# Altium schematic sheet 05_LMS7002M_RF.SchDoc: LMS7002M RF
size A3 portrait; Organization: Lime Microsystems; Address1: Surrey Tech Centre; Address2: Guildford GU2 7YG; Address3: Surrey; Address4: United Kingdom; Revision: v1.3; SheetNumber: 5; SheetTotal: 9; PageSetup: Record=PageOptions|CenterHorizontal=True|CenterVertical=True|PrintScale=0.70|XCorrection=1.00|YCorrection=1.00|PrintKind=1|BorderSize=5000000|LeftOffset=0|BottomOffset=0|Orientation=1|PaperLength=2970|PaperWidth=2100|Scale=100|PaperSource=7|PrintQuality=600|MediaType=1|DitherType=10|PrintScaleMode=1|PaperKind=A4|PaperIndex=9
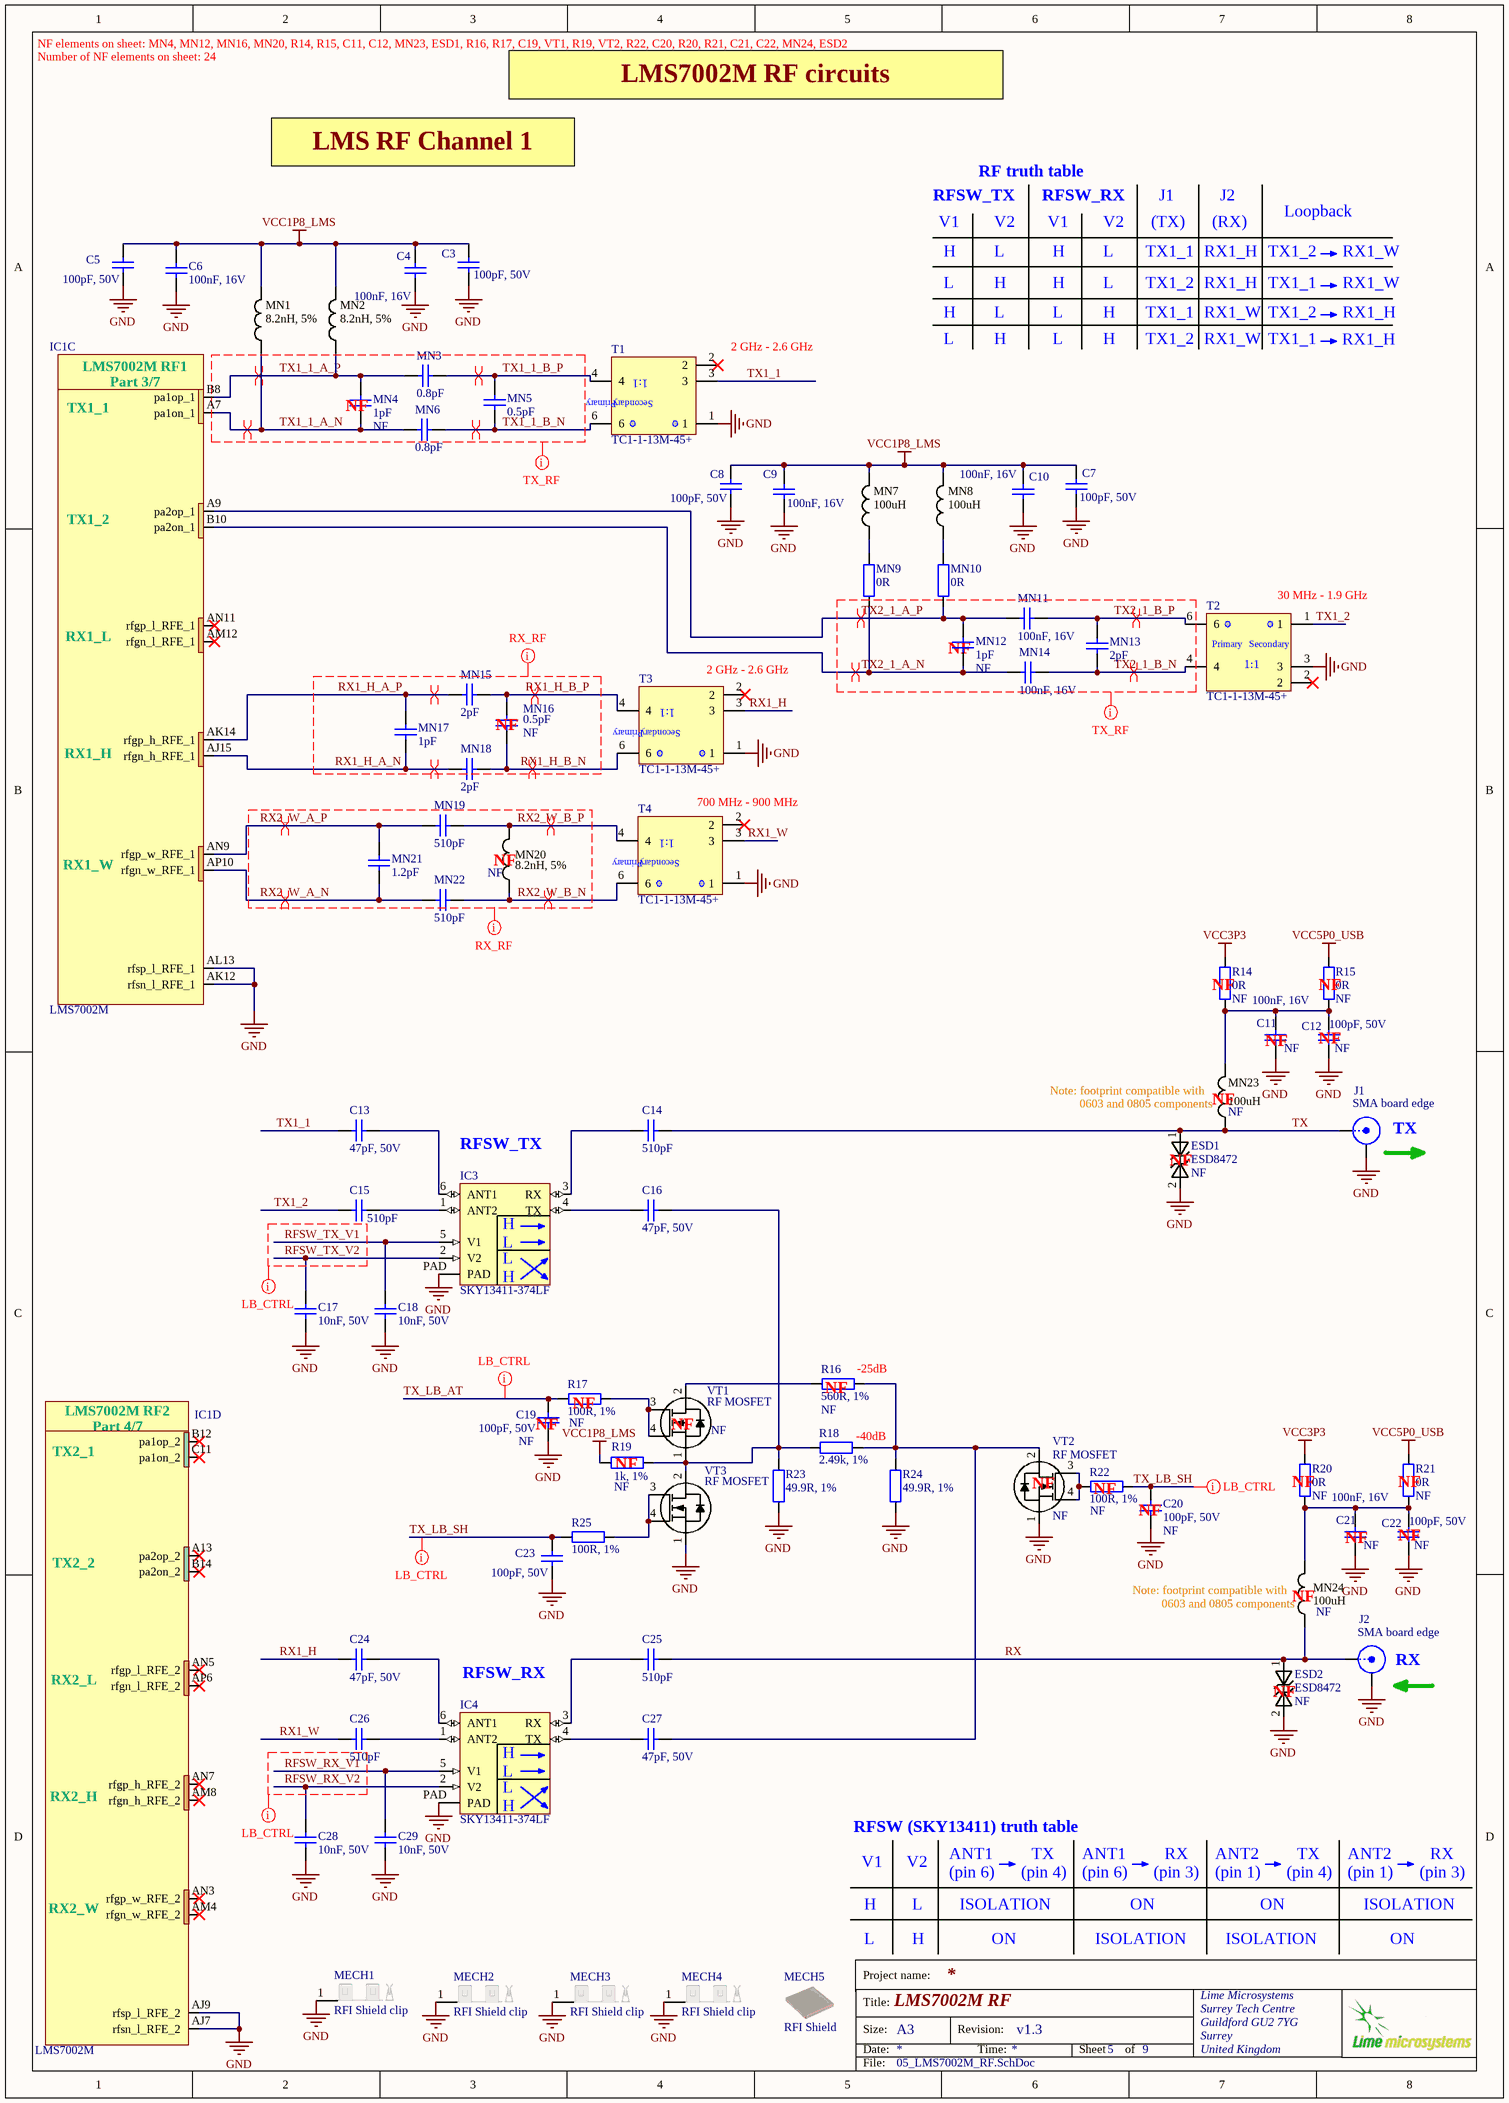
[diagram p0: 05_LMS7002M_RF.SchDoc]

## Parts
C3  100pF, 50V  [CAP0402]
C4  100nF, 16V  [CAP0402]
C5  100pF, 50V  [CAP0402]
C6  100nF, 16V  [CAP0402]
C7  100pF, 50V  [CAP0402]
C8  100pF, 50V  [CAP0402]
C9  100nF, 16V  [CAP0402]
C10  100nF, 16V  [CAP0402]
C11  100nF, 16V  Assembly Info: NF  [CAP0402]
C12  100pF, 50V  Assembly Info: NF  [CAP0402]
C13  47pF, 50V  [CAP0402]
C14  510pF  [CAP0402]
C15  510pF  [CAP0402]
C16  47pF, 50V  [CAP0402]
C17  10nF, 50V  [CAP0402]
C18  10nF, 50V  [CAP0402]
C19  100pF, 50V  Assembly Info: NF  [CAP0402]
C20  100pF, 50V  Assembly Info: NF  [CAP0402]
C21  100nF, 16V  Assembly Info: NF  [CAP0402]
C22  100pF, 50V  Assembly Info: NF  [CAP0402]
C23  100pF, 50V  [CAP0402]
C24  47pF, 50V  [CAP0402]
C25  510pF  [CAP0402]
C26  510pF  [CAP0402]
C27  47pF, 50V  [CAP0402]
C28  10nF, 50V  [CAP0402]
C29  10nF, 50V  [CAP0402]
ESD1  ESD8472  Assembly Info: NF  [ESD8472_X3DFN2]
ESD2  ESD8472  Assembly Info: NF  [ESD8472_X3DFN2]
IC1  LMS7002M  [LMS7002M_v5]  (parts C,D of 7)
IC3  SKY13411-374LF  [SKY13411-374LF]
IC4  SKY13411-374LF  [SKY13411-374LF]
J1  SMA board edge  [SMA_connector_board_edge_SM]
J2  SMA board edge  [SMA_connector_board_edge_SM]
MECH1  RFI Shield clip  [RFI_SHIELD_CLPS_MINI]
MECH2  RFI Shield clip  [RFI_SHIELD_CLPS_MINI]
MECH3  RFI Shield clip  [RFI_SHIELD_CLPS_MINI]
MECH4  RFI Shield clip  [RFI_SHIELD_CLPS_MINI]
MECH5  RFI Shield  [WurthElectronic_RF_shield]
MN1  8.2nH, 5%  [RES0402]
MN2  8.2nH, 5%  [RES0402]
MN3  0.8pF  [CAP0402]
MN4  1pF  Assembly Info: NF  [CAP0402]
MN5  0.5pF  [CAP0402]
MN6  0.8pF  [CAP0402]
MN7  100uH  [RES0805]
MN8  100uH  [RES0805]
MN9  0R  [RES0402]
MN10  0R  [RES0402]
MN11  100nF, 16V  [CAP0402]
MN12  1pF  Assembly Info: NF  [CAP0402]
MN13  2pF  [CAP0402]
MN14  100nF, 16V  [CAP0402]
MN15  2pF  [CAP0402]
MN16  0.5pF  Assembly Info: NF  [CAP0402]
MN17  1pF  [CAP0402]
MN18  2pF  [CAP0402]
MN19  510pF  [CAP0402]
MN20  8.2nH, 5%  Assembly Info: NF  [RES0402]
MN21  1.2pF  [CAP0402]
MN22  510pF  [CAP0402]
MN23  100uH  Assembly Info: NF  [RES0805_0603]
MN24  100uH  Assembly Info: NF  [RES0805_0603]
R14  0R  Assembly Info: NF  [RES0402]
R15  0R  Assembly Info: NF  [RES0402]
R16  560R, 1%  Assembly Info: NF  [RES0402]
R17  100R, 1%  Assembly Info: NF  [RES0402]
R18  2.49k, 1%  [RES0402]
R19  1k, 1%  Assembly Info: NF  [RES0402]
R20  0R  Assembly Info: NF  [RES0402]
R21  0R  Assembly Info: NF  [RES0402]
R22  100R, 1%  Assembly Info: NF  [RES0402]
R23  49.9R, 1%  [RES0402]
R24  49.9R, 1%  [RES0402]
R25  100R, 1%  [RES0402]
T1  TC1-1-13M-45+  [TC1-1-13MA+_JA4220-AL_]
T2  TC1-1-13M-45+  [TC1-1-13MA+_JA4220-AL_]
T3  TC1-1-13M-45+  [TC1-1-13MA+_JA4220-AL_]
T4  TC1-1-13M-45+  [TC1-1-13MA+_JA4220-AL_]
VT1  RF MOSFET  Assembly Info: NF  [BF1105R_SOT143R4]
VT2  RF MOSFET  Assembly Info: NF  [BF1105R_SOT143R4]
VT3  RF MOSFET  [BF1105R_SOT143R4]

## Nets
GND: C3.2 C4.1 C5.2 C6.1 C7.2 C8.2 C9.1 C10.1 C11.1 C12.2 C17.1 C18.1 C19.2 C20.2 C21.1 C22.2 C23.2 C28.1 C29.1 ESD1.2 ESD2.2 IC1.AJ7(rfsn_l_RFE_2) IC1.AJ9(rfsp_l_RFE_2) IC1.AK12(rfsn_l_RFE_1) IC1.AL13(rfsp_l_RFE_1) IC3.PAD IC4.PAD J1.2(Y) J2.2(Y) MECH1.1(GND) MECH2.1(GND) MECH3.1(GND) MECH4.1(GND) R23.1 R24.1 T1.1 T2.3 T3.1 T4.1 VT2.1(S) VT3.1(S)
VCC1P8_LMS: C3.1 C4.2 C5.1 C6.2 C7.1 C8.1 C9.2 C10.2 MN1.2 MN2.2 MN7.2 MN8.2 R19.2
VCC3P3: R14.1 R20.1
VCC5P0_USB: R15.1 R21.1
RFSW_RX_V1: C29.2 IC4.5(V1)
RFSW_RX_V2: C28.2 IC4.2(V2)
RFSW_TX_V1: C18.2 IC3.5(V1)
RFSW_TX_V2: C17.2 IC3.2(V2)
RX: C25.2 ESD2.1 J2.1(X) MN24.1
RX1_H: C24.2 T3.3
RX1_H_A_N: IC1.AJ15(rfgn_h_RFE_1) MN17.1 MN18.2
RX1_H_A_P: IC1.AK14(rfgp_h_RFE_1) MN15.2 MN17.2
RX1_H_B_N: MN16.1 MN18.1 T3.6
RX1_H_B_P: MN15.1 MN16.2 T3.4
RX1_W: C26.2 T4.3
RX2_W_A_N: IC1.AP10(rfgn_w_RFE_1) MN21.1 MN22.2
RX2_W_A_P: IC1.AN9(rfgp_w_RFE_1) MN19.2 MN21.2
RX2_W_B_N: MN20.1 MN22.1 T4.6
RX2_W_B_P: MN19.1 MN20.2 T4.4
TX: C14.2 ESD1.1 J1.1(X) MN23.1
TX1_1: C13.2 T1.3
TX1_1_A_N: IC1.A7(pa1on_1) MN1.1 MN4.1 MN6.2
TX1_1_A_P: IC1.B8(pa1op_1) MN2.1 MN3.1 MN4.2
TX1_1_B_N: MN5.2 MN6.1 T1.6
TX1_1_B_P: MN3.2 MN5.1 T1.4
TX1_2: C15.2 T2.1
TX2_1_A_N: IC1.B10(pa2on_1) MN9.1 MN12.2 MN14.1
TX2_1_A_P: IC1.A9(pa2op_1) MN10.1 MN11.2 MN12.1
TX2_1_B_N: MN13.1 MN14.2 T2.4
TX2_1_B_P: MN11.1 MN13.2 T2.6
TX_LB_AT: C19.1 R17.2
TX_LB_SH: C20.1 C23.1 R22.1 R25.2
NetC11_2: C11.2 C12.1 MN23.2 R14.2 R15.2
NetC13_1: C13.1 IC3.6(ANT1)
NetC14_1: C14.1 IC3.3(RX)
NetC15_1: C15.1 IC3.1(ANT2)
NetC16_1: C16.1 IC3.4(TX)
NetC16_2: C16.2 R18.1 R19.1 R23.2 VT1.1(S) VT3.2(D)
NetC21_2: C21.2 C22.1 MN24.2 R20.2 R21.2
NetC24_1: C24.1 IC4.6(ANT1)
NetC25_1: C25.1 IC4.3(RX)
NetC26_1: C26.1 IC4.1(ANT2)
NetC27_1: C27.1 IC4.4(TX)
NetC27_2: C27.2 R16.1 R18.2 R24.2 VT2.2(D)
NetMN7_1: MN7.1 MN9.2
NetMN8_1: MN8.1 MN10.2
NetR16_2: R16.2 VT1.2(D)
NetR17_1: R17.1 VT1.3(G2) VT1.4(G1)
NetR22_2: R22.2 VT2.3(G2) VT2.4(G1)
NetR25_1: R25.1 VT3.3(G2) VT3.4(G1)

Not connected (* = marked no-connect by the designer): IC1 A13(pa2op_2)* AM4(rfgn_w_RFE_2)* AM8(rfgn_h_RFE_2)* AM12(rfgn_l_RFE_1)* AN3(rfgp_w_RFE_2)* AN5(rfgp_l_RFE_2)* AN7(rfgp_h_RFE_2)* AN11(rfgp_l_RFE_1)* AP6(rfgn_l_RFE_2)* B12(pa1op_2)* B14(pa2on_2)* C11(pa1on_2)*; T1 2*; T2 2*; T3 2*; T4 2*

## Layout directives
differential pair: RX1_H_A_N, RX1_H_A_P, RX1_H_B_N, RX1_H_B_P, RX2_W_A_N, RX2_W_A_P, RX2_W_B_N, RX2_W_B_P, TX1_1_A_N, TX1_1_A_P, TX1_1_B_N, TX1_1_B_P, TX2_1_A_N, TX2_1_A_P, TX2_1_B_N, TX2_1_B_P
net class TX_RF: TX1_1_A_N, TX1_1_A_P, TX1_1_B_N, TX1_1_B_P, TX2_1_A_N, TX2_1_A_P, TX2_1_B_N, TX2_1_B_P
net class RX_RF: RX1_H_A_N, RX1_H_A_P, RX1_H_B_N, RX1_H_B_P, RX2_W_A_N, RX2_W_A_P, RX2_W_B_N, RX2_W_B_P
net class LB_CTRL: RFSW_RX_V1, RFSW_RX_V2, RFSW_TX_V1, RFSW_TX_V2, TX_LB_AT, TX_LB_SH

## Notes on the sheet
- Number of NF elements on sheet: 24
- NF elements on sheet: MN4, MN12, MN16, MN20, R14, R15, C11, C12, MN23, ESD1, R16, R17, C19, VT1, R19, VT2, R22, C20, R20, R21, C21, C22, MN24, ESD2
- LMS7002M RF circuits
- LMS RF Channel 1
- RFSW_TX
- V1
- RF truth table
- V2
- RFSW_RX
- (TX)
- J1
- (RX)
- J2
- Loopback
- H
- L
- TX1_1
- TX1_2
- RX1_H
- RX1_W
- (near T1) 2 GHz - 2.6 GHz
- (near MN4) NF
- (near T2) 30 MHz - 1.9 GHz
- (near T3) 2 GHz - 2.6 GHz
- (near MN12) NF
- (near MN16) NF
- (near T4) 700 MHz - 900 MHz
- (near MN20) NF
- (near R14) NF
- (near C11) NF
- (near C12) NF
- (near R15) NF
- (near MN23) Note: footprint compatible with
- (near MN23) 0603 and 0805 components
- (near MN23) NF
- (near IC3) RFSW_TX
- (near ESD1) NF
- (near J1) TX
- (near IC3) H
- (near IC3) L
- (near R16) -25dB
- (near C19) NF
- (near R17) NF
- (near VT1) NF
- (near R16) NF
- (near R18) -40dB
- (near R19) NF
- (near VT2) NF
- (near R22) NF
- (near C20) NF
- (near R20) NF
- (near R21) NF
- (near C21) NF
- (near C22) NF
- (near MN24) Note: footprint compatible with
- (near MN24) 0603 and 0805 components
- (near MN24) NF
- (near IC4) RFSW_RX
- (near ESD2) NF
- (near J2) RX
- (near IC4) H
- (near IC4) L
- RFSW (SKY13411) truth table
- ANT1
- (pin 6)
- ISOLATION
- (pin 4)
- TX
- ON
- (pin 3)
- RX
- ANT2
- (pin 1)
- Project name:
- Title:
- Size:
- Date:
- A3
- Revision:
- Time:
- Sheet
- of
- File:
- (in symbol LMS7002Mr3, part C) LMS7002M RF1; Part 3/7; TX1_1; TX1_2; RX1_L; RX1_H; RX1_W
- (in symbol LMS7002Mr3, part D) LMS7002M RF2; Part 4/7; TX2_1; TX2_2; RX2_L; RX2_H; RX2_W
- (in symbol TC1-1-13M+) 1:1; Primary; Secondary

## Library data of the parts
C3 C5 C7 C8 C12 C19 C20 C22 C23 = Cap_0402: Manufacturer Part Number 1: CC0402JRNPO9BN101; Manufacturer: Yageo; Part Description: 100pF ±5% 50V C0G, NP0 Ceramic Capacitor -55°C ~ 125°C Surface Mount, MLCC 0402 (1005 Metric) 0.039" L x 0.020" W (1.00mm x 0.50mm); Tolerance: ±5%; Temperature Coefficient: C0G, NP0; Value: 100pF, 50V; Capacitance: 100pF; Thickness (Max): 0.022" (0.55mm); Size / Dimension: 0.039" L x 0.020" W (1.00mm x 0.50mm); RoHS: RoHS Compliant; Ratings: -; Package / Case: 0402 (1005 Metric); Mounting Type: Surface Mount, MLCC; Height - Seated (Max): -; Features: -; Lead Spacing: -; Voltage - Rated: 50V; Operating Temperature: -55°C ~ 125°C; Packaging: Cut Tape (CT); Applications: General Purpose; Lead Style: -; Supplier 1: Digi-Key; Category: Capacitors; Supplier Part Number 1: 311-1024-1-ND
C4 C6 C9-C11 C21 = Cap_0402: Manufacturer: Murata Electronics; Manufacturer Part Number: GRM155R71C104KA88D; Part Description: 0.10µF ±10% 16V X7R Ceramic Capacitor -55°C ~ 125°C Surface Mount, MLCC 0402 (1005 Metric) 0.039" L x 0.020" W (1.00mm x 0.50mm); Tolerance: 10 %; Type: General Purpose MLCC; Capacitance: 0.1 uF; Case Length: 1 mm; Dielectric: X7R; Case Height: 0.5 mm; Temperature Coefficient / Code: +/- 15 %; Value: 100nF, 16V; Supplier 1: Mouser; Supplier Part Number 1: 81-GRM155R71C104KA88; Case Code - in: 0402; RoHS: RoHS Compliant; Operating Temperature Range: - 55 C to + 125 C; Series: GRM; Termination Style: SMD/SMT; Package / Case: 0402 (1005 metric); Voltage Rating DC: 16 V; Maximum Operating Temperature: + 125 C; Case Code - mm: 1005; Minimum Operating Temperature: - 55 C; Product Category: Low & Medium Capacitance SMD Ceramic Chip Capacitors; Packaging: Reel; Product: General Type MLCCs; Category: Multilayer Ceramic Capacitors MLCC - SMD/SMT; Brand: Murata Electronics; Case Width: 0.5 mm; RoHS - Mouser: Y; Standard Pack Qty: 10000; Minimum Order Quantity: 1; Reeling: True; Manufacturer Part Number 1: GRM155R71C104KA88D
C13 C16 C24 C27 = Cap_0402: Manufacturer Part Number 1: GRM1555C1H470FA01D; Manufacturer: TDK Corporation; Part Description: 47pF ±1% 50V C0G, NP0 Ceramic Capacitor -55°C ~ 125°C Surface Mount, MLCC 0402 (1005 Metric) 0.039" L x 0.020" W (1.00mm x 0.50mm); Temperature Coefficient: C0G, NP0; Tolerance: ±1%; Value: 47pF, 50V; Supplier 1: Digi-Key; Supplier Part Number 1: 490-6241-1-ND; Package / Case: 0402 (1005 Metric); Voltage - Rated: 50V; Lead Spacing: -; Ratings: -; Mounting Type: Surface Mount, MLCC; Operating Temperature: -55°C ~ 125°C; Thickness (Max): 0.022" (0.55mm); Capacitance: 47pF; Packaging: Cut Tape (CT); Features: -; Applications: General Purpose; Lead Style: -; Size / Dimension: 0.039" L x 0.020" W (1.00mm x 0.50mm); Height - Seated (Max): -; RoHS: RoHS Compliant; Category: Capacitors
C14 C15 C25 C26 MN19 MN22 = Cap_0402: Manufacturer: Murata Electronics North America; Manufacturer Part Number 1: GRM1555C1H511JA01D; Part Description: 510pF ±5% 50V C0G, NP0 Ceramic Capacitor -55°C ~ 125°C Surface Mount, MLCC 0402 (1005 Metric) 0.039" L x 0.020" W (1.00mm x 0.50mm); Voltage - Rated: 50V; Temperature Coefficient: C0G, NP0; Tolerance: ±5%; Value: 510pF; Supplier 1: Digi-Key; Supplier Part Number 1: 490-3237-1-ND; Height - Seated (Max): -; Features: -; Size / Dimension: 0.039" L x 0.020" W (1.00mm x 0.50mm); Applications: General Purpose; Lead Spacing: -; Package / Case: 0402 (1005 Metric); Ratings: -; Thickness (Max): 0.022" (0.55mm); Lead Style: -; Operating Temperature: -55°C ~ 125°C; Mounting Type: Surface Mount, MLCC; Capacitance: 510pF; Category: Capacitors; RoHS: RoHS Compliant; Packaging: Cut Tape (CT)
C17 = Cap_0402: Manufacturer: Murata; Manufacturer Part Number 1: GRM155R71H103KA88D; Part Description: 10000pF ±10% 50V Ceramic Capacitor X7R 0402 (1005 Metric); Description: CAP CER 10000PF 50V X7R 0402; Material: Ceramic; Tolerance: 10%; Dielectric: X7R; Voltage: 25V; value: 10nF, 50V; Supplier 1: Digi-Key; Supplier Part Number 1: 490-4516-1-ND; Stock 1: 8941817; Pricing 1: 1=0,10000, 10=0,03800, 100=0,01690, 500=0,01208, 1000=0,00949, 2500=0,00862, 5000=0,00794 (USD); RoHS: Yes; Mount: Surface Mount; Case/Package: 0402; Number of Pins: 2; Case Code (Metric): 1005; Case Code (Imperial): 0402; Min Operating Temperature: -55°C; Max Operating Temperature: 125°C; Capacitance: 10nF; Packaging: Tape and Reel; Voltage Rating (DC): 50V; Package Quantity: 1; Voltage Rating: 50V; Termination: SMD/SMT; Length: 1mm; Height: 0.5mm; Width: 0.02inch; Thickness: 0.022inch; Depth: 0.5mm; Radiation Hardening: No; REACH SVHC: No SVHC; Lead Free: Lead Free
C18 C28 C29 = Cap_0402: Manufacturer: Murata; Manufacturer Part Number 1: GRM155R71H103KA88D; Part Description: 10000pF ±10% 50V Ceramic Capacitor X7R 0402 (1005 Metric); Dielectric: X7R; Material: Ceramic; Tolerance: 10%; Voltage: 25V; Supplier 1: Digi-Key; Supplier Part Number 1: 490-4516-1-ND; Capacitance: 10nF; value: 10nF, 50V; Packaging: Tape and Reel; Voltage Rating: 50V; Case/Package: 0402; Case Code (Imperial): 0402; Case Code (Metric): 1005; Depth: 0.5mm; Height: 0.5mm; Lead Free: Lead Free; Length: 1mm; Max Operating Temperature: 125°C; Min Operating Temperature: -55°C; Mount: Surface Mount; Number of Pins: 2; Package Quantity: 1; Pricing 1: 1=0,10000, 10=0,03800, 100=0,01690, 500=0,01208, 1000=0,00949, 2500=0,00862, 5000=0,00794 (USD); Radiation Hardening: No; REACH SVHC: No SVHC; RoHS: Yes; Stock 1: 8941817; Termination: SMD/SMT; Thickness: 0.022inch; Voltage Rating (DC): 50V; Width: 0.02inch
ESD1 ESD2 = ESD8472: Manufacturer: ON Semiconductor; Manufacturer Part Number 1: ESD8472MUT5G; Part Description: TVS DIODE 5.3VWM 14VC X3DFN2; Voltage - Reverse Standoff (Typ): 5.3V (Max); Voltage - Breakdown (Min): 7V; Voltage - Clamping (Max) @ Ipp: 14V; Current - Peak Pulse (10/1000µs): 3A (8/20µs); Power Line Protection: No; Capacitance @ Frequency: 0.2pF @ 1MHz; Supplier 1: Digi-Key; RoHS: RoHS Compliant; Category: Circuit Protection; Stock 1: 2295; Pricing 1: 1=0.39, 10=0.315, 100=0.2142, 500=0.16068, 1000=0.12051 (USD); Packaging: Cut Tape (CT); Part Status: Active; Type: Zener; Power - Peak Pulse: -; Applications: Automotive, RF Antenna; Operating Temperature: -55°C ~ 150°C (TJ); Mounting Type: Surface Mount; Package / Case: 2-XFDFN; Supplier Device Package: 2-X3DFN (0.62x0.32); ComponentLink1URL: http://www.onsemi.com/pub/Collateral/ESD8472-D.PDF; ComponentLink1Description: http://www.onsemi.com/pub/Collateral/ESD8472-D.PDF; Supplier Part Number 1: ESD8472MUT5GOSCT-ND
IC1 = LMS7002Mr3: Schematic symbol revision 3. Default footprint - 0.31mm pad; Manufacturer: Lime Microsystems; Part Description: IC FPRF Transceiver LMS7002M; 261 pin aQFN; Supplier 1: Lime Microsystems; Supplier Part Number 1: LMS7002M; Manufacturer Part Number 1: LMS7002M
IC3 IC4 = SKY13411-374LF: Manufacturer: Skyworks Solutions Inc.; Part Description: RF Switch IC 802.11a/b/g/n DPDT 50 Ohm 6-MLPD (1.5x1.5); Frequency - Lower: 100MHz; Isolation @ Frequency: 14dB @ 6GHz (typ); Insertion Loss @ Frequency: 0.9dB @ 6GHz; IIP3: 50dBm (typ); Topology: Reflective; Circuit: DPDT; P1dB: 30dBm (typ) IP1dB; Impedance: 50 Ohm; RF Type: 802.11a/b/g/n; Supplier 1: Digi-Key; Manufacturer Part Number 1: SKY13411-374LF; RoHS: RoHS Compliant; Category: RF/IF and RFID; Stock 1: 18782; Pricing 1: 1=0.88, 10=0.782, 100=0.6099, 500=0.50382, 1000=0.39776 (USD); Packaging: Cut Tape (CT); Part Status: Active; Features: -; Operating Temperature: -40°C ~ 85°C; Voltage - Supply: -; Package / Case: 6-XFDFN Exposed Pad; Supplier Device Package: 6-MLPD (1.5x1.5); ComponentLink1URL: http://www.skyworksinc.com/uploads/documents/201665B.pdf; ComponentLink1Description: http://www.skyworksinc.com/uploads/documents/201665B.pdf; Supplier Part Number 1: 863-1455-1-ND
J1 J2 = RF_IF_connector: CONN SMA JACK STR 50OHM EDGE MNT; Manufacturer: RF Solutions; Manufacturer Part Number 1: CON-SMA-EDGE-S; Part Description: SMA Connector Jack, Female Socket Board Edge, End Launch Solder; Connector Type: Jack, Female Socket; Contact Termination: Solder; Supplier 1: Digi-Key; Supplier Part Number 1: CON-SMA-EDGE-S-ND; RoHS: RoHS Compliant; Category: Connectors, Interconnects; Stock 1: 1751; Pricing 1: 1=2.1 (USD); Packaging: -; Part Status: Active; Connector Style: SMA; Shield Termination: Solder; Impedance: -; Mounting Type: Board Edge, End Launch; Mounting Feature: -; Cable Group: -; Fastening Type: Threaded; Frequency - Max: -; Features: -; Housing Color: -; Ingress Protection: -; Includes: -; Body Material: -; Body Finish: -; Center Contact Plating: -; Dielectric Material: -; Operating Temperature: -; Center Contact Material: -; Voltage Rating: -; Mating Cycles: -; Insertion Loss: -; ComponentLink1URL: http://media.digikey.com/pdf/Data%20Sheets/RF%20Solutions%20PDFs/CON-SMA-EDGE.pdf; ComponentLink1Description: http://media.digikey.com/pdf/Data%20Sheets/RF%20Solutions%20PDFs/CON-SMA-EDGE.pdf
MECH1-MECH4 = RFI_SHIELD_CLIP: Manufacturer: HARWIN; Part Description: RFI SHIELD CLIP MINI TIN SMD; Manufacturer Part Number 1: S0971-46R; SVHC: No SVHC (15-Jun-2015); Supplier 1: Farnell; Supplier: Farnell; Length: 5.8; Clip Type: RFI Shield Clip; Clip Diameter: -; Product Range: -; Mounting Hole Dia: -; RoHS: YES; Supplier Part Number 1: 2361677
MECH5 = RFI_SHIELD_1: Part Description: Enclosure, Shielding Cabinet Cover, Shielding Cabinet, 25 mm, 25 mm, 3 mm, Tin Plate; Manufacturer: WURTH ELEKTRONIK; Manufacturer Part Number 1: 36003250; Enclosure Material: Tin Plate; External Height - Metric: 25; External Height - Imperial: 0.98"; Enclosure Type: Shielding Cabinet; External Depth - Metric: 3; External Depth - Imperial: 0.12"; Supplier 1: Farnell; Supplier: Farnell; RoHS: YES; IP Rating: -; External Width - Imperial: 0.98"; NEMA Rating: -; External Width - Metric: 25; Supplier Part Number 1: 1909662
MN1 MN2 MN20 = Inductor_0603: Manufacturer: COILCRAFT; Manufacturer Part Number 1: 0402HP-8N2XJLU; Part Description: Surface Mount High Frequency Inductor, 0402HP Series, 8.2 nH, ± 5%, 0402 [1005 Metric], 5.4 GHz; Inductor Construction: Wirewound; DC Current Rating: 1.5; Inductor Case Style: 0402 [1005 Metric]<!--FANDB--><div class="features-and-benefits-container"></div>; Self Resonant Frequency Min: 5.4; DC Resistance Max: 0.065; High Frequency Inductor Case: 0402 [1005 Metric]; SVHC: No SVHC (16-Jun-2014); Inductance: 8.2; Supplier 1: Farnell; Supplier Part Number 1: 2285826; Packaging: Cut Tape; Product Range: COILCRAFT - 0402; Inductance Tolerance: ± 5%; RoHS: Y-EX; Value: 8.2nH, 5%
MN3 MN6 = Cap_0402: Manufacturer: Murata Electronics North America; Manufacturer Part Number 1: GRM1555C1HR80BA01D; Part Description: 0.80pF ±0.1pF 50V C0G, NP0 Ceramic Capacitor -55°C ~ 125°C Surface Mount, MLCC 0402 (1005 Metric) 0.039" L x 0.020" W (1.00mm x 0.50mm); Temperature Coefficient: C0G, NP0; Capacitance: 0.80pF; Voltage - Rated: 50V; Tolerance: ±0.1pF; Value: 0.8pF; Applications: General Purpose; Operating Temperature: -55°C ~ 125°C; Size / Dimension: 0.039" L x 0.020" W (1.00mm x 0.50mm); Features: -; Supplier 1: Digi-Key; Height - Seated (Max): -; Category: Capacitors; Package / Case: 0402 (1005 Metric); Mounting Type: Surface Mount, MLCC; Lead Spacing: -; Thickness (Max): 0.022" (0.55mm); RoHS: RoHS Compliant; Supplier Part Number 1: 490-6269-1-ND; Packaging: Cut Tape (CT); Ratings: -; Lead Style: -
MN4 MN12 MN17 = Cap_0402: Manufacturer: TDK Corporation; Manufacturer Part Number 1: C1005C0G1H010B050BA; Part Description: 1pF ±0.1pF 50V C0G, NP0 Ceramic Capacitor -55°C ~ 125°C Surface Mount, MLCC 0402 (1005 Metric) 0.039" L x 0.020" W (1.00mm x 0.50mm); Voltage - Rated: 50V; Temperature Coefficient: C0G, NP0; Tolerance: ±0.1pF; Value: 1pF; Supplier 1: Digi-Key; Supplier Part Number 1: 445-4854-6-ND; Size / Dimension: 0.039" L x 0.020" W (1.00mm x 0.50mm); Lead Spacing: -; Operating Temperature: -55°C ~ 125°C; Thickness (Max): 0.022" (0.55mm); Package / Case: 0402 (1005 Metric); Features: -; Lead Style: -; Applications: General Purpose; Height - Seated (Max): -; Capacitance: 1pF; RoHS: RoHS Compliant; Mounting Type: Surface Mount, MLCC; Packaging: Digi-Reel®; Ratings: -; Category: Capacitors
MN5 MN16 = Cap_0402: Manufacturer: Yageo; Manufacturer Part Number 1: CC0402CRNPO9BNR50; Part Description: 0.50pF ±0.25pF 50V C0G, NP0 Ceramic Capacitor -55°C ~ 125°C Surface Mount, MLCC 0402 (1005 Metric) 0.039" L x 0.020" W (1.00mm x 0.50mm); Capacitance: 0.50pF; Voltage - Rated: 50V; Temperature Coefficient: C0G, NP0; Tolerance: ±0.25pF; Value: 0.5pF; Supplier 1: Digi-Key; Supplier Part Number 1: 311-1001-1-ND; RoHS: RoHS Compliant; Thickness (Max): 0.022" (0.55mm); Features: -; Height - Seated (Max): -; Lead Spacing: -; Applications: General Purpose; Packaging: Cut Tape (CT); Ratings: -; Size / Dimension: 0.039" L x 0.020" W (1.00mm x 0.50mm); Lead Style: -; Mounting Type: Surface Mount, MLCC; Operating Temperature: -55°C ~ 125°C; Package / Case: 0402 (1005 Metric); Category: Capacitors
MN7 MN8 MN23 MN24 = Inductor_0603: Manufacturer: TDK Corporation; Manufacturer Part Number 1: MLF2012C101KT000; Part Description: FIXED IND 100UH 2MA 3.1 OHM SMD; Q @ Freq: 25 @ 1MHz; Shielding: Shielded; Current Rating: 2mA; Frequency - Self Resonant: 7MHz; Frequency - Test: 1MHz; Material - Core: Ferrite; Tolerance: ±10%; Inductance: 100µH; DC Resistance (DCR): 3.1 Ohm Max; Value: 100uH; Supplier 1: Digi-Key; Supplier Part Number 1: 445-1071-1-ND; Supplier Device Package: 0805 (2012 Metric); Size / Dimension: 0.079" L x 0.049" W (2.00mm x 1.25mm); Operating Temperature: -40°C ~ 85°C; Packaging: Cut Tape (CT); RoHS: RoHS Compliant; Current - Saturation: -; Height - Seated (Max): 0.057" (1.45mm); Package / Case: 0805 (2012 Metric); Mounting Type: Surface Mount; Type: Multilayer; Category: Inductors, Coils, Chokes
MN9 MN10 R14 R15 R20 R21 = Res_0402: Manufacturer: Yageo; Part Description: RES SMD 0.0OHM JUMPER 1/16W 0402; Manufacturer Part Number 1: RC0402JR-070RL; Supplier 1: Digi-Key; Supplier Part Number 1: 311-0.0JRTR-ND; Composition: Thick Film; Package / Case: 0402 (1005 Metric); Category: Resistors; Value: 0R
MN11 MN14 = Cap_0402: Manufacturer: Murata Electronics; Manufacturer Part Number: GRM155R71C104KA88D; Part Description: 0.10µF ±10% 16V X7R Ceramic Capacitor -55°C ~ 125°C Surface Mount, MLCC 0402 (1005 Metric) 0.039" L x 0.020" W (1.00mm x 0.50mm); Tolerance: 10 %; Capacitance: 0.1 uF; Case Length: 1 mm; Dielectric: X7R; Case Height: 0.5 mm; Temperature Coefficient / Code: +/- 15 %; Value: 100nF, 16V; Supplier 1: Mouser; Supplier Part Number 1: 81-GRM155R71C104KA88; Case Code - in: 0402; RoHS: RoHS Compliant; Operating Temperature Range: - 55 C to + 125 C; Series: GRM; Termination Style: SMD/SMT; Package / Case: 0402 (1005 metric); Voltage Rating DC: 16 V; Type: General Purpose MLCC; Maximum Operating Temperature: + 125 C; Case Code - mm: 1005; Minimum Operating Temperature: - 55 C; Product Category: Low & Medium Capacitance SMD Ceramic Chip Capacitors; Packaging: Reel; Product: General Type MLCCs; Category: Multilayer Ceramic Capacitors MLCC - SMD/SMT; Brand: Murata Electronics; Case Width: 0.5 mm; RoHS - Mouser: Y; Standard Pack Qty: 10000; Minimum Order Quantity: 1; Reeling: True; Manufacturer Part Number 1: GRM155R71C104KA88D
MN13 MN15 MN18 = Cap_0402: Manufacturer Part Number 1: 04025U2R0BAT2A; Manufacturer: AVX; Part Description: SMD Multilayer Ceramic Capacitor, U Series, 2 pF, ± 0.1pF, C0G / NP0, 50 V, 0402 [1005 Metric]; Product Range: U Series; Voltage Rating: 50; SVHC: No SVHC (17-Dec-2014); Capacitance Tolerance: ± 0.1; Ceramic Capacitor Case: 0402 [1005 Metric]; Capacitance: 2; Dielectric Characteristic: C0G / NP0; Value: 2pF; Supplier 1: Farnell; Supplier Part Number 1: 2332536; Operating Temperature Max: 125; RoHS: YES; Operating Temperature Min: -55; Capacitance Tolerance ±: ± 0.1; Packaging: Cut Tape; MSL: MSL 1 - Unlimited
MN21 = Cap_0402: Manufacturer: Murata Electronics North America; Manufacturer Part Number 1: GRM1555C1H1R2CA01D; Part Description: '1.2pF ±0.25pF 50V C0G, NP0 Ceramic Capacitor -55°C ~ 125°C Surface Mount, MLCC 0402 (1005 Metric) 0.039" L x 0.020" W (1.00mm x 0.50mm); Temperature Coefficient: C0G, NP0; Voltage - Rated: 50V; Tolerance: ±0.25pF; Value: 1.2pF; Supplier 1: Digi-Key; Supplier Part Number 1: 490-5927-1-ND; Lead Style: -; Category: Capacitors; Features: -; Packaging: Cut Tape (CT); Operating Temperature: -55°C ~ 125°C; Package / Case: 0402 (1005 Metric); Applications: General Purpose; Size / Dimension: 0.039" L x 0.020" W (1.00mm x 0.50mm); Lead Spacing: -; Ratings: -; Mounting Type: Surface Mount, MLCC; RoHS: RoHS Compliant; Height - Seated (Max): -; Thickness (Max): 0.022" (0.55mm); Capacitance: 1.2pF
R16 = Res_0402: Manufacturer Part Number 1: CRCW0402560RFKED; Manufacturer: Vishay Dale; Part Description: RES SMD 560 OHM 1% 1/16W 0402; Resistance (Ohms): 560; Power (Watts): 0.063W, 1/16W; Temperature Coefficient: ±100ppm/°C; RoHS: RoHS Compliant; Packaging: Cut Tape (CT); Composition: Thick Film; Tolerance: ±1%; Number of Terminations: 2; Supplier Device Package: 0402 (1005 Metric); Operating Temperature: -55°C ~ 155°C; Features: Automotive AEC-Q200; Category: Resistors; Supplier Part Number 1: 541-560LCT-ND; Package / Case: 0402 (1005 Metric); Supplier 1: Digi-Key; Height: 0.016" (0.40mm); Size / Dimension: 0.039" L x 0.020" W (1.00mm x 0.50mm)
R17 R22 R25 = Res_0402: Manufacturer Part Number 1: RMCF0402FT100R; Part Description: RES SMD 100 OHM 1% 1/16W 0402; Manufacturer: Stackpole Electronics Inc.; Temperature Coefficient: ±100ppm/°C; Supplier 1: Digi-Key; Supplier Part Number 1: RMCF0402FT100RDKR-ND; Package / Case: 0402 (1005 Metric); Composition: Thick Film; Category: Resistors; Tolerance: ±1%; Value: 100R, 1%
R18 = Res_0402: Manufacturer Part Number 1: RC0402FR-072K49L; Manufacturer: Yageo; Part Description: RES SMD 2.49K OHM 1% 1/16W 0402; Temperature Coefficient: ±100ppm/°C; Power (Watts): 0.063W, 1/16W; Value: 2.49k, 1%; Size / Dimension: 0.039" L x 0.020" W (1.00mm x 0.50mm); Height: 0.016" (0.40mm); Features: Moisture Resistant; Resistance (Ohms): 2.49k; Operating Temperature: -55°C ~ 155°C; Tolerance: ±1%; Composition: Thick Film; Supplier Device Package: 0402; Package / Case: 0402 (1005 Metric); Number of Terminations: 2; Category: Resistors; Packaging: Digi-Reel®; Supplier Part Number 1: 311-2.49KLRDKR-ND; RoHS: RoHS Compliant; Supplier 1: Digi-Key
R19 = Res_0402: Manufacturer: Stackpole Electronics Inc; Manufacturer Part Number 1: RMCF0402FT1K00; Part Description: RES SMD 1K OHM 1% 1/16W 0402; Temperature Coefficient: ±100ppm/°C; Power (Watts): 0.063W, 1/16W; Value: 1k, 1%; Supplier 1: Digi-Key; Supplier Part Number 1: RMCF0402FT1K00TR-ND; Resistance (Ohms): 1k; Packaging: Tape & Reel (TR); Category: Resistors; RoHS: RoHS Compliant; Tolerance: ±1%; Height: 0.016" (0.40mm); Number of Terminations: 2; Package / Case: 0402 (1005 Metric); Operating Temperature: -55°C ~ 155°C; Features: -; Composition: Thick Film; Supplier Device Package: 0402; Size / Dimension: 0.039" L x 0.020" W (1.00mm x 0.50mm)
R23 R24 = Res_0402: Manufacturer: Samsung Electro-Mechanics America, Inc.; Manufacturer Part Number 1: RC1005F49R9CS; Part Description: RES SMD 49.9 OHM 1% 1/16W 0402; Temperature Coefficient: ±100ppm/°C; Resistance (Ohms): 49.9; Power (Watts): 0.063W, 1/16W; Number of Terminations: 2; Size / Dimension: 0.039" L x 0.020" W (1.00mm x 0.50mm); Supplier Device Package: 0402 (1005 Metric); RoHS: RoHS Compliant; Supplier Part Number 1: 1276-3469-6-ND; Features: -; Packaging: Digi-Reel®; Tolerance: ±1%; Height: 0.016" (0.40mm); Category: Resistors; Composition: Thick Film; Package / Case: 0402 (1005 Metric); Supplier 1: Digi-Key; Operating Temperature: -55°C ~ 155°C; Value: 49.9R, 1%
T1-T4 = TC1-1-13M+: Part Description: RF balun; 1:1 ratio; 3 dB bandwidth: 0.3 MHz to 3.5 GHz; 3.8mm x 3.8mm; Manufacturer 1: Minicircuits; Supplier 1: Minicircuits; Manufacturer Part Number 1: TC1-1-13M-45+; Supplier Part Number 1: TC1-1-13M-45+
VT1-VT3 = BF1105R,215: Manufacturer: NXP Semiconductors; Part Description: RF MOSFET Transistors Trans MOSFET N-CH 7V 0.03A 4pin(3+Tab); Voltage - Rated: 7V; Noise Figure: 1.7dB; Current Rating: 30mA; Gain: 20dB; Transistor Type: N-Channel Dual Gate; Frequency: 800MHz; Voltage - Test: 5V; Supplier 1: Digi-Key; RoHS: RoHS Compliant; Supplier Device Package: SOT-143R; Power - Output: -; Current - Test: -; Manufacturer Part Number 1: BF1105R,215; Packaging: Digi-Reel®; Package / Case: SOT-143R; Category: Discrete Semiconductor Products; Supplier Part Number 1: 568-12530-6-ND